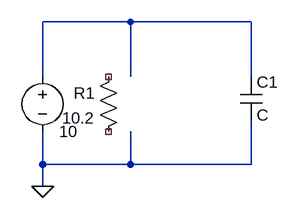
[diagram p0: schematic SYMATTRTYPE_ERROR.asc]
SYMATTRTYPE_ERROR.asc, the LTspice schematic file:
Version 4
SHEET 1 880 680
WIRE 320 16 192 16
WIRE 496 16 320 16
WIRE 192 96 192 16
WIRE 320 96 320 16
WIRE 496 96 496 16
WIRE 192 224 192 176
WIRE 320 224 320 176
WIRE 320 224 192 224
WIRE 496 224 496 160
WIRE 496 224 320 224
WIRE 192 256 192 224
FLAG 192 256 0
SYMBOL voltage 192 80 R0
WINDOW 123 0 0 Left 0
WINDOW 39 0 0 Left 0
SYMATTR InstNam V1
SYMATTR Value 10
SYMBOL res 304 80 M0
SYMATTR InstName R1
SYMATTR Value 10.2
SYMATTR SpiceLine tol=1 pwr=0.1
SYMBOL cap 480 96 R0
SYMATTR InstName C1

The netlist it stands for:
* SYMATTRTYPE_ERROR.asc
V§? N001 0 10
R1 NC_01 NC_02 10.2 tol=1 pwr=0.1
C1 N001 0 C
.backanno
.end